# Altium schematic sheet NucleoG031K8Sch.SchDoc
size A; SheetNumber: 1; SheetTotal: 1
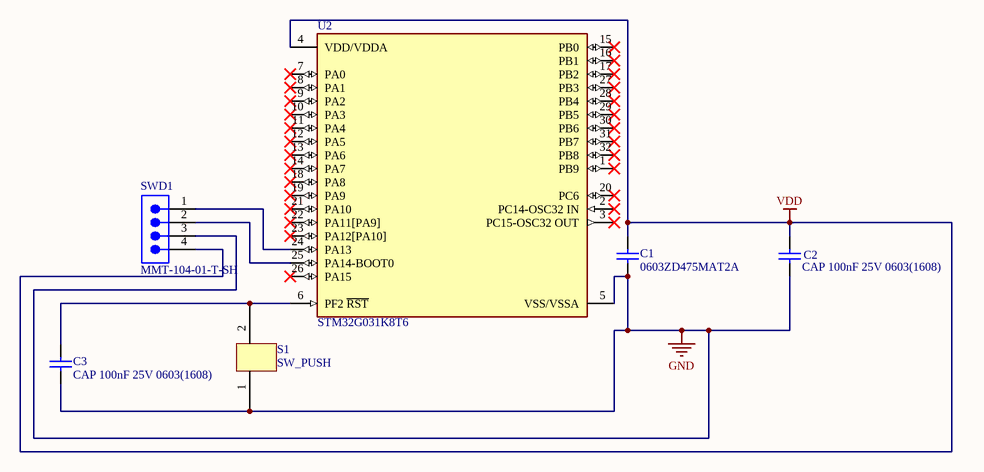
[diagram p0: NucleoG031K8Sch.SchDoc]

## Parts
C1  0603ZD475MAT2A  [CAPC1608X90X35NL15T15]
C2  CAP 100nF 25V 0603(1608)  [CAPC0603(1608)100_N]
C3  CAP 100nF 25V 0603(1608)  [CAPC0603(1608)100_N]
S1  SW_PUSH  [SW_2PIN]
SWD1  MMT-104-01-T-SH  [SMTC-MMT-104-01-X-SH]
U2  STM32G031K8T6  [FP-LQFP32-5V-MFG]

## Nets
GND: C1.1 C2.1 C3.1 S1.1 SWD1.3(GND) U2.5(VSS/VSSA)
VDD: C1.2 C2.2 SWD1.4(VDD) U2.4(VDD/VDDA)
NetC3_2: C3.2 S1.2 U2.6(PF2_~{RST})
NetSWD1_1: SWD1.1(SWDIO) U2.24(PA13)
NetSWD1_2: SWD1.2(SWDCLK) U2.25(PA14-BOOT0)

Not connected (* = marked no-connect by the designer): U2 1(PB9)* 2(PC14-OSC32_IN)* 3(PC15-OSC32_OUT)* 7(PA0)* 8(PA1)* 9(PA2)* 10(PA3)* 11(PA4)* 12(PA5)* 13(PA6)* 14(PA7)* 15(PB0)* 16(PB1)* 17(PB2)* 18(PA8)* 19(PA9)* 20(PC6)* 21(PA10)* 22(PA11[PA9])* 23(PA12[PA10])* 26(PA15)* 27(PB3)* 28(PB4)* 29(PB5)* 30(PB6)* 31(PB7)* 32(PB8)*

## Library data of the parts
C1 = CMP-1035-02787-2: Manufacturer: AVX Interconnect / Elco; Part Number: 0603ZD475MAT2A
C2 C3 = CMP-1035-02589-1: CAP 100nF 25V ±20% 0603 (1608 Metric) Thickness 1mm SMD; Case-EIA: 0603; Tolerance: Â±20%; Case-Metric: 1608; Value: 100nF; Max Thickness: 1 mm; Technology: SMT; Rated Voltage: 25 V
SWD1 = CMP-1029-00049-1: Horizontal Surface Mount Header, -55 to 105 degC, 2 mm Pitch, 4-Pin, Male, RoHS; Manufacturer: Samtec; Pitch: 2 mm; Orientation: Horizontal; RoHS: True; Mounting Technology: Surface Mount; PackageReference: MMT-104-01-X-SH; ComponentLink2URL: http://d2a072wq521u33.cloudfront.net/catalog_english//MMT_SM.PDF; Temperature Range: -55 to 105 degC; PartNumber: MMT-104-01-T-SH; ComponentLink1Description: Manufacturer URL; PackageVersion: CY, 12/2000; ComponentLink1URL: http://www.samtec.com; ComponentLink3Description: Package Specification; ComponentLink3URL: http://www.samtec.com/documents/webfiles/cpdf/MMT-1XX-XX-XX-XX-XX-XXX-X-XX-MKT.pdf; PackageDescription: 2mm Horizontal Terminal Surface Mount Strip ASSEM; DatasheetVersion: F-214; ComponentLink2Description: Datasheet
U2 = CMP-12105-000118-1: IC MCU 32BIT 64KB FLASH 32LQFP